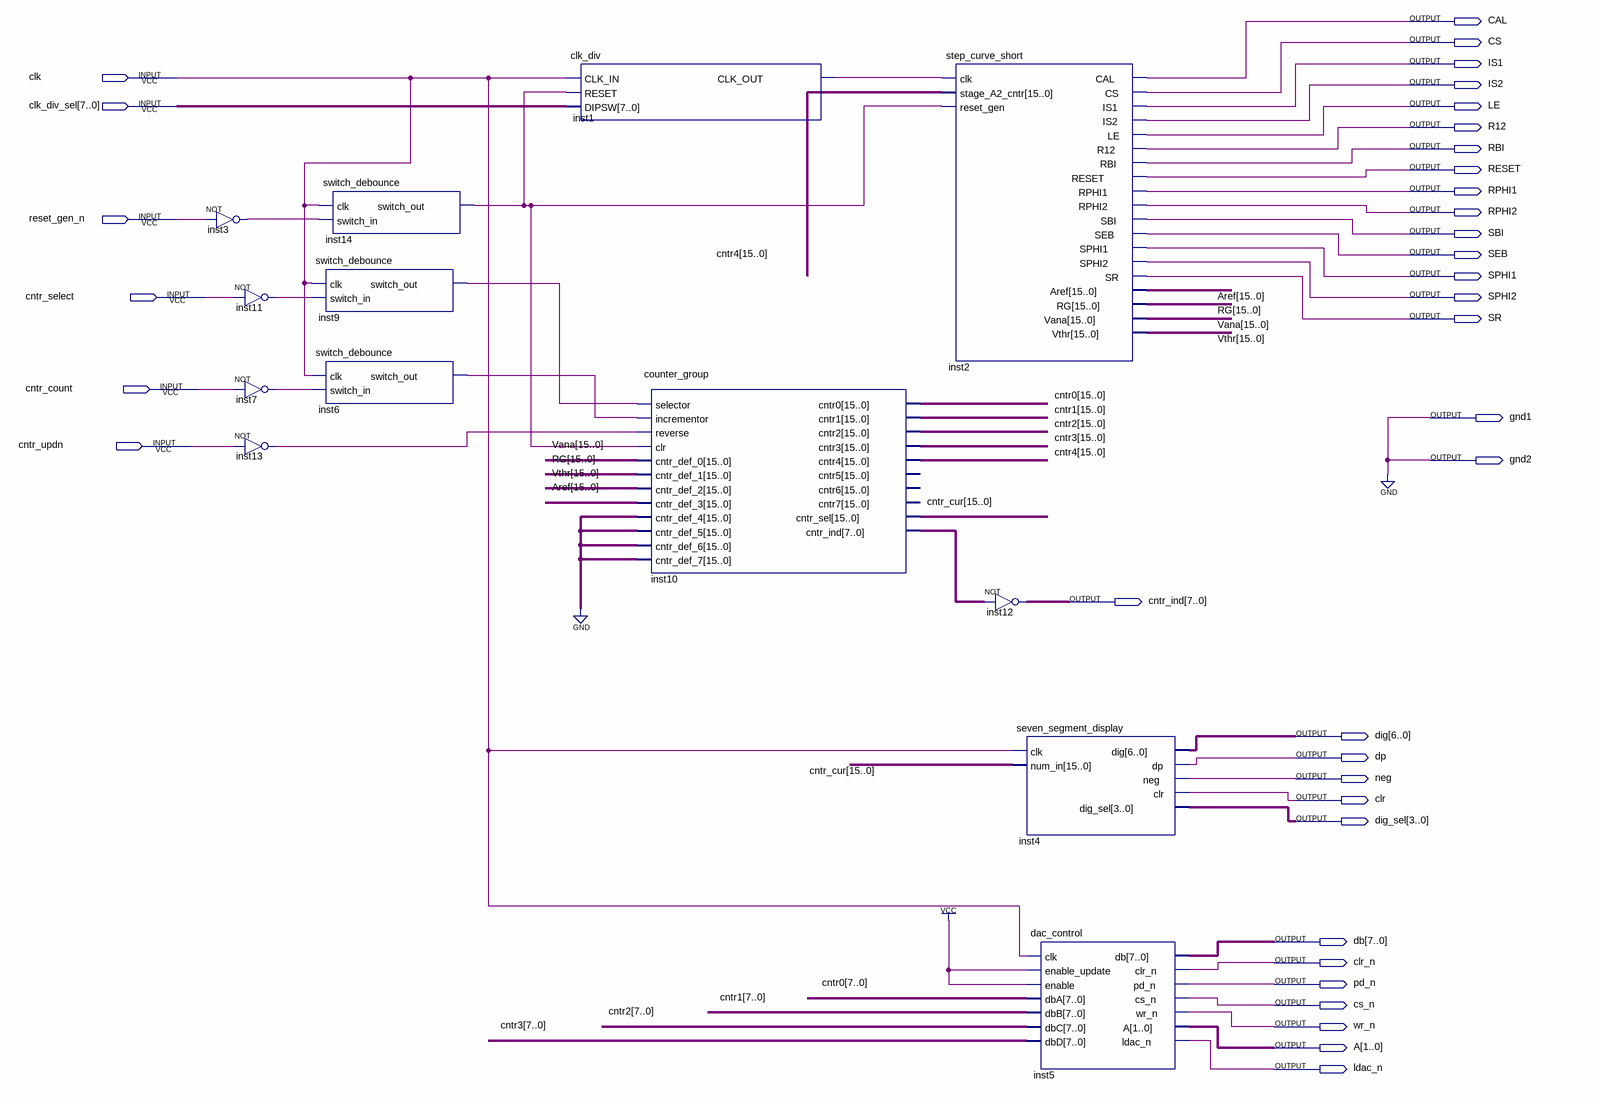
[diagram p0: schematic sheet]
// Quartus schematic pattern_generator.bdf as structural Verilog: 13 symbols, 36 pins
module pattern_generator (
  input  clk,
  input  [7:0] clk_div_sel,
  input  reset_gen_n,
  input  cntr_select,
  input  cntr_count,
  input  cntr_updn,
  output CAL,
  output CS,
  output IS1,
  output IS2,
  output LE,
  output R12,
  output RBI,
  output RESET,
  output RPHI1,
  output RPHI2,
  output SBI,
  output SEB,
  output SPHI1,
  output SPHI2,
  output SR,
  output gnd1,
  output gnd2,
  output [7:0] cntr_ind,
  output [6:0] dig,
  output dp,
  output neg,
  output clr,
  output [3:0] dig_sel,
  output [7:0] db,
  output clr_n,
  output pd_n,
  output cs_n,
  output wr_n,
  output [1:0] A,
  output ldac_n
);

  wire inst1_clk_out, inst3_out, inst6_switch_out, inst7_out, inst9_switch_out, inst11_out, inst13_out,
       inst14_switch_out;
  wire [7:0] inst10_cntr_ind;
  wire [15:0] Aref, cntr0, cntr1, cntr2, cntr3, cntr4, cntr_cur, RG, Vana, Vthr;

  not inst3 (inst3_out, reset_gen_n);
  not inst11 (inst11_out, cntr_select);
  not inst7 (inst7_out, cntr_count);
  not inst13 (inst13_out, cntr_updn);
  switch_debounce inst14 (.clk(clk), .switch_in(inst3_out), .switch_out(inst14_switch_out));
  switch_debounce inst9 (.clk(clk), .switch_in(inst11_out), .switch_out(inst9_switch_out));
  switch_debounce inst6 (.clk(clk), .switch_in(inst7_out), .switch_out(inst6_switch_out));
  clk_div inst1 (.CLK_IN(clk), .RESET(inst14_switch_out), .DIPSW(clk_div_sel), .CLK_OUT(inst1_clk_out));
  counter_group inst10 (
    .selector(inst9_switch_out), .incrementor(inst6_switch_out), .reverse(inst13_out),
    .clr(inst14_switch_out), .cntr_def_0(Vana), .cntr_def_1(RG), .cntr_def_2(Vthr), .cntr_def_3(Aref),
    .cntr_def_4({16{1'b0}}), .cntr_def_5({16{1'b0}}), .cntr_def_6({16{1'b0}}), .cntr_def_7({16{1'b0}}),
    .cntr0(cntr0), .cntr1(cntr1), .cntr2(cntr2), .cntr3(cntr3), .cntr4(cntr4), .cntr_sel(cntr_cur),
    .cntr_ind(inst10_cntr_ind));  // open: cntr5, cntr6, cntr7
  step_curve_short inst2 (
    .clk(inst1_clk_out), .stage_A2_cntr(cntr4), .reset_gen(inst14_switch_out), .CAL(CAL), .CS(CS), .IS1(IS1),
    .IS2(IS2), .LE(LE), .R12(R12), .RBI(RBI), .RESET(RESET), .RPHI1(RPHI1), .RPHI2(RPHI2), .SBI(SBI),
    .SEB(SEB), .SPHI1(SPHI1), .SPHI2(SPHI2), .SR(SR), .Aref(Aref), .RG(RG), .Vana(Vana), .Vthr(Vthr));
  assign cntr_ind = ~inst10_cntr_ind;  // NOT inst12, 8 bits wide
  seven_segment_display inst4 (
    .clk(clk), .num_in(cntr_cur), .dig(dig), .dp(dp), .neg(neg), .clr(clr), .dig_sel(dig_sel));
  dac_control inst5 (
    .clk(clk), .enable_update(1'b1), .enable(1'b1), .dbA(cntr0[7:0]), .dbB(cntr1[7:0]), .dbC(cntr2[7:0]),
    .dbD(cntr3[7:0]), .db(db), .clr_n(clr_n), .pd_n(pd_n), .cs_n(cs_n), .wr_n(wr_n), .A(A), .ldac_n(ldac_n));

  assign gnd1 = 1'b0;
  assign gnd2 = 1'b0;
endmodule
